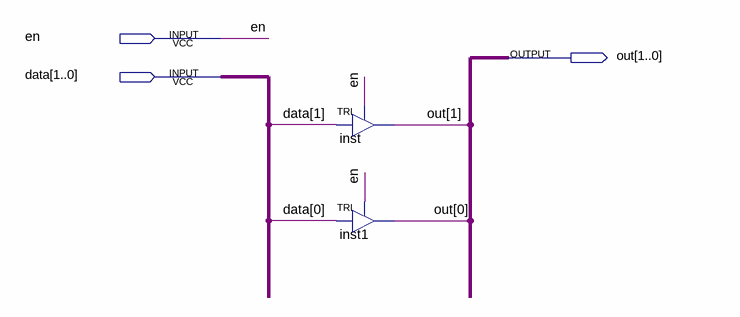
[diagram p0: schematic sheet]
// Quartus schematic tri_2Bit.bdf as structural Verilog: 2 symbols, 3 pins
module tri_2Bit (
  input  en,
  input  [1:0] data,
  output [1:0] out
);

  TRI inst (.IN(data[1]), .OE(en), .OUT(out[1]));
  TRI inst1 (.IN(data[0]), .OE(en), .OUT(out[0]));
endmodule
